# EAGLE design Dragino-MS14-S-Relay-Board (EAGLE 7.6.0)
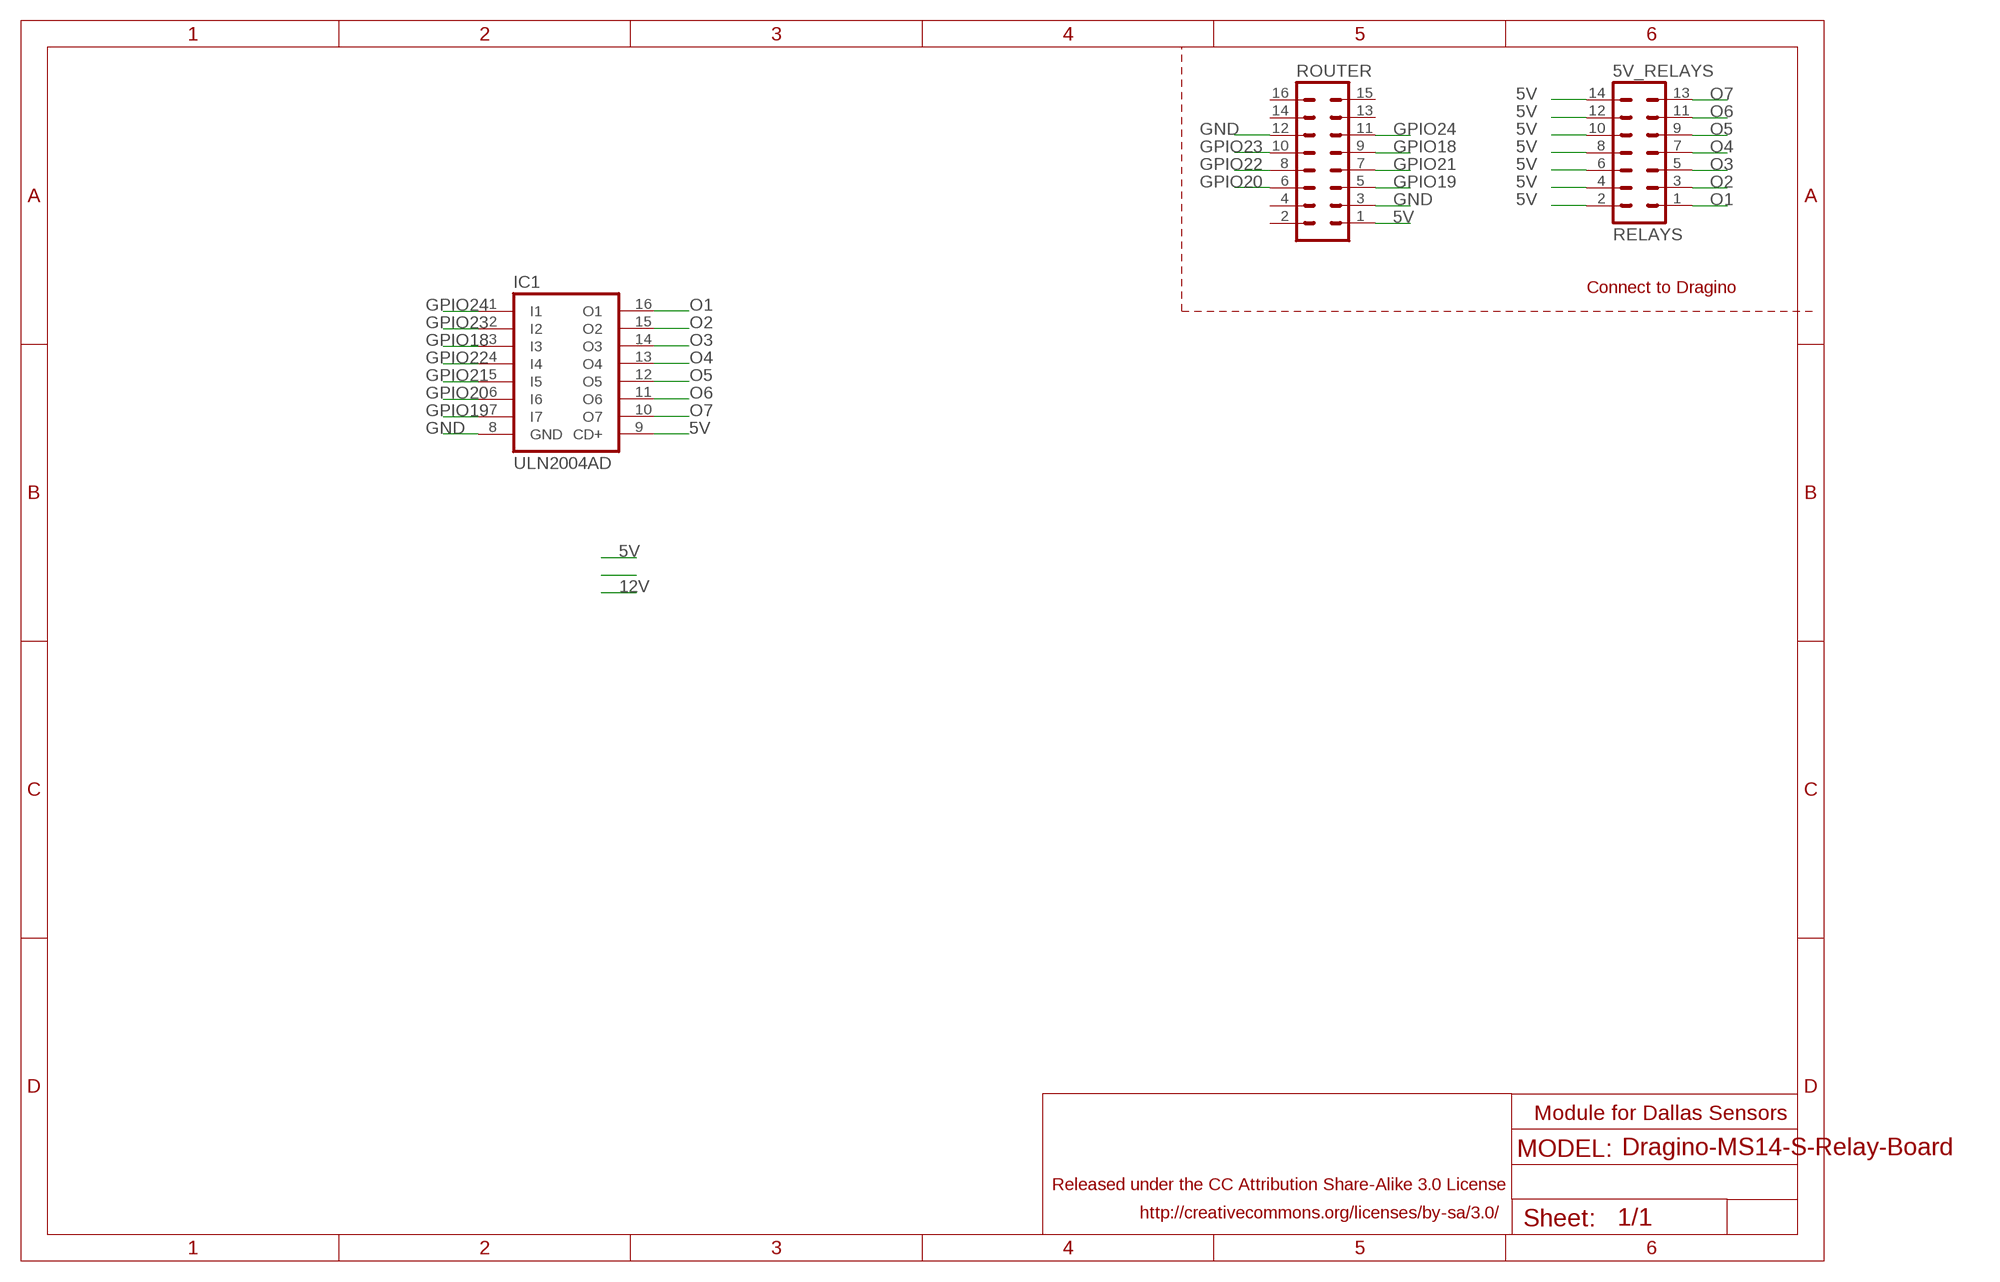
[diagram p0: schematic, sheet 1]

## Parts
5V_RELAYS  RELAYS  MA07-2  [MA07-2]
IC1  ULN2004AD  [SO16]
ROUTER  MA08-2  [MA08-2]

## Nets
5V [power]: 5V_RELAYS.2 5V_RELAYS.4 5V_RELAYS.6 5V_RELAYS.8 5V_RELAYS.10 5V_RELAYS.12 5V_RELAYS.14 IC1.9(CD+) ROUTER.1
GND [gnd]: IC1.8(GND) ROUTER.3 ROUTER.12
GPIO18: IC1.3(I3) ROUTER.9
GPIO19: IC1.7(I7) ROUTER.5
GPIO20: IC1.6(I6) ROUTER.6
GPIO21: IC1.5(I5) ROUTER.7
GPIO22: IC1.4(I4) ROUTER.8
GPIO23: IC1.2(I2) ROUTER.10
GPIO24: IC1.1(I1) ROUTER.11
O1 [power]: 5V_RELAYS.1 IC1.16(O1)
O2 [power]: 5V_RELAYS.3 IC1.15(O2)
O3 [power]: 5V_RELAYS.5 IC1.14(O3)
O4 [power]: 5V_RELAYS.7 IC1.13(O4)
O5 [power]: 5V_RELAYS.9 IC1.12(O5)
O6 [power]: 5V_RELAYS.11 IC1.11(O6)
O7 [power]: 5V_RELAYS.13 IC1.10(O7)
Unconnected: ROUTER.2 ROUTER.4 ROUTER.13 ROUTER.14 ROUTER.15 ROUTER.16

## Notes on the sheet
- Connect to Dragino
- Module for Dallas Sensors

## Library data of the parts
5V_RELAYS = dragino:MA07-2: PIN HEADER; OC_FARNELL: unknown; OC_NEWARK: unknown
IC1 = uln-udn:ULN2004A: DRIVER ARRAY
ROUTER = dragino:MA08-2: PIN HEADER; OC_FARNELL: unknown; OC_NEWARK: unknown

## Net classes
0 default: width 0.254 mm, clearance 0.254 mm
1 power: width 0.406 mm, drill 0.406 mm, clearance 0.254 mm
2 gnd: width 0.305 mm, drill 0.381 mm, clearance 0.254 mm
3 usbvcc: width 0.508 mm, drill 0.61 mm, clearance 0.254 mm
4 aref: width 0.406 mm, drill 0.61 mm, clearance 0.254 mm

## Board
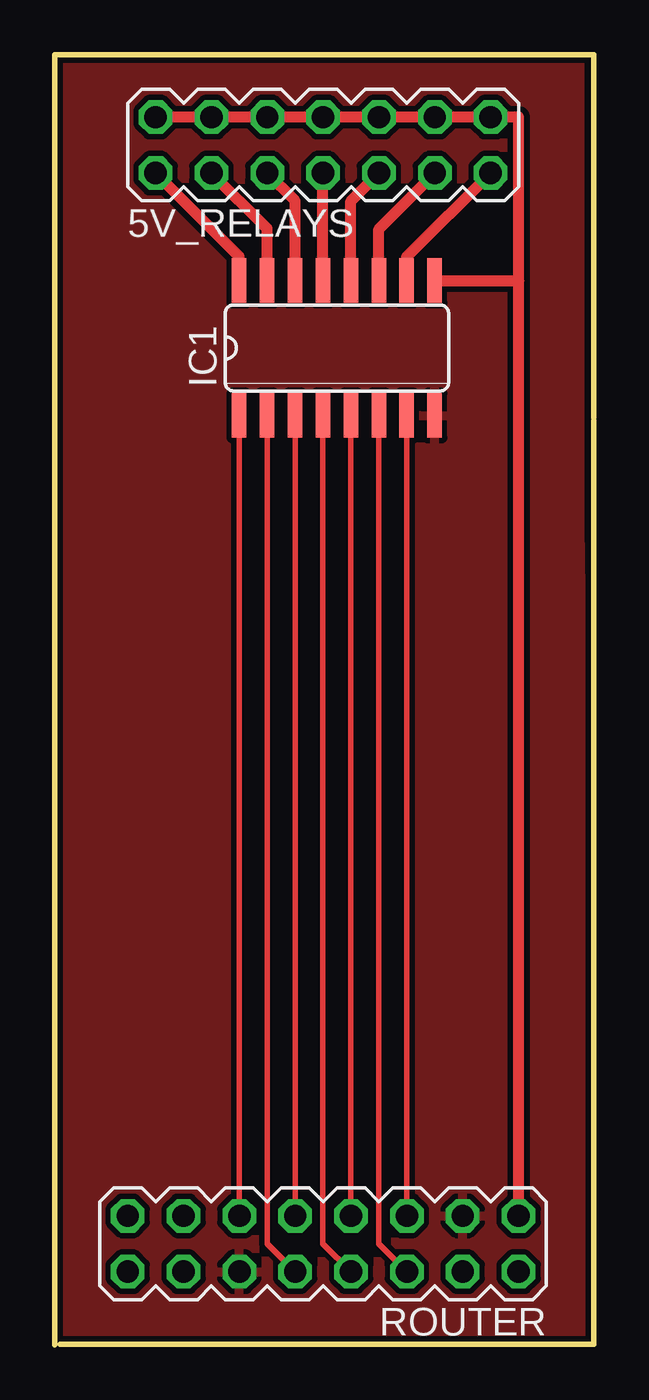
[diagram p1: board, top side]
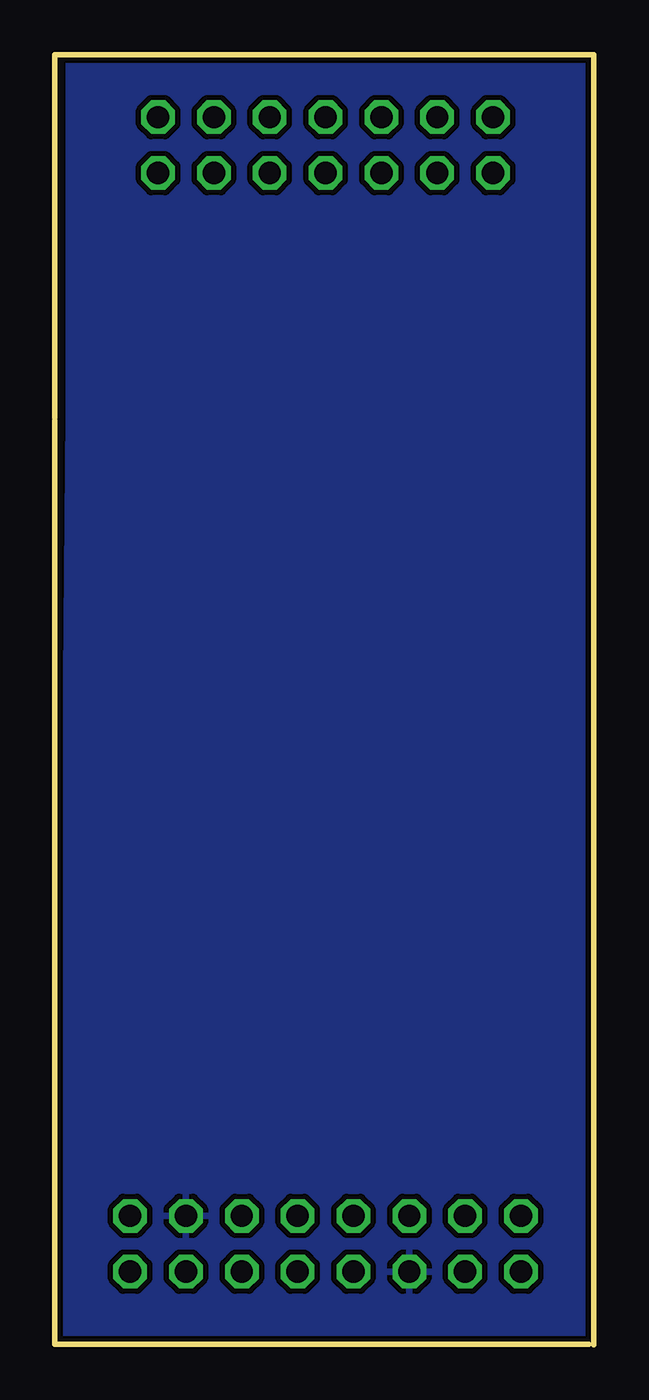
[diagram p2: board, bottom side, seen from below]

Size 24.51 x 58.69 mm. Coordinates in mm from the lower left corner, seen from the top.
Outline: 24.51,42.18 24.51,58.69 0,58.69 0,0
Outline: 24.51,42.05 24.51,0.02 0.24,0.02
Copper layers (1*16): Top 0.035mm / dielectric 1.5mm / Bottom 0.035mm
Design rules "SeeedStudio_2layer_DRU_no_angle_20140221": minimum track width 6mil, minimum drill 12mil, track to track 6mil, track to pad 6mil, pad to pad 6mil, via to via 6mil, smd to smd 0mil, copper to edge 10mil, drill to drill 10mil, minimum pad ring 10mil, minimum via ring 6mil, stop-mask expansion 2mil, vias tented up to drill 100mil, thermal gap 10mil

### Footprints (pad centres in the part's own frame; a part is rotated, then mirrored left to right if it is on the bottom)
MA07-2 = drill 1.016 octagon: 1 -7.62,-1.27; 2 -7.62,1.27; 3 -5.08,-1.27; 4 -5.08,1.27; 5 -2.54,-1.27; 6 -2.54,1.27; 7 0,-1.27; 8 0,1.27; 9 2.54,-1.27; 10 2.54,1.27; 11 5.08,-1.27; 12 5.08,1.27; 13 7.62,-1.27; 14 7.62,1.27
SO16 = smd 0.66 x 2.032: 1 -4.445,-3.073; 2 -3.175,-3.073; 3 -1.905,-3.073; 4 -0.635,-3.073; 5 0.635,-3.073; 6 1.905,-3.073; 7 3.175,-3.073; 8 4.445,-3.073; 9 4.445,3.073; 10 3.175,3.073; 11 1.905,3.073; 12 0.635,3.073; 13 -0.635,3.073; 14 -1.905,3.073; 15 -3.175,3.073; 16 -4.445,3.073
MA08-2 = drill 1.016 octagon: 1 -8.89,-1.27; 2 -8.89,1.27; 3 -6.35,-1.27; 4 -6.35,1.27; 5 -3.81,-1.27; 6 -3.81,1.27; 7 -1.27,-1.27; 8 -1.27,1.27; 9 1.27,-1.27; 10 1.27,1.27; 11 3.81,-1.27; 12 3.81,1.27; 13 6.35,-1.27; 14 6.35,1.27; 15 8.89,-1.27; 16 8.89,1.27

### Placement (x,y rotation side)
5V_RELAYS  12.2,54.59 0 top
IC1  12.83,45.36 0 top
ROUTER  12.2,4.59 180 top

### Tracks (layer width: path | path; a pad name or v marks a point on that pad's centre or on a via)
5V
  Top 0.508: 5V_RELAYS.2 5V_RELAYS.4 5V_RELAYS.6 5V_RELAYS.8 5V_RELAYS.10 5V_RELAYS.12 5V_RELAYS.14 21.09,55.86 21.09,48.4 | ROUTER.1 21.09,48.4 | IC1.9 21.09,48.43 21.09,48.4
GND
  pour Top: 0,58.56 23.88,58.56 23.88,37.23 24.13,21.48 24.13,-0.62 0,-0.62
  pour Bottom: 0.25,58.82 0.25,-0.62 24.13,-0.62 24.13,16.14 23.88,42.31 23.88,58.82
GPIO18
  Top 0.254: ROUTER.9 IC1.3
GPIO19
  Top 0.254: ROUTER.5 IC1.7
GPIO20
  Top 0.254: ROUTER.6 14.73,4.6 IC1.6
GPIO21
  Top 0.254: ROUTER.7 IC1.5
GPIO22
  Top 0.254: ROUTER.8 12.19,4.6 IC1.4
GPIO23
  Top 0.254: ROUTER.10 9.65,4.6 IC1.2
GPIO24
  Top 0.254: ROUTER.11 IC1.1
O1
  Top 0.508: IC1.16 8.38,49.52 5V_RELAYS.1
O2
  Top 0.508: IC1.15 9.65,50.79 5V_RELAYS.3
O3
  Top 0.508: IC1.14 10.92,52.06 5V_RELAYS.5
O4
  Top 0.508: IC1.13 5V_RELAYS.7
O5
  Top 0.508: IC1.12 13.46,52.04 5V_RELAYS.9
O6
  Top 0.508: IC1.11 14.73,50.77 5V_RELAYS.11
O7
  Top 0.508: IC1.10 16,49.5 5V_RELAYS.13

### Text on the board
bNames: designed by | MADE IN | tinker it | ITALY | ATMEGA328
214bmp: D:/SmartProjects/Snc/a4_bn_logo2.bmp